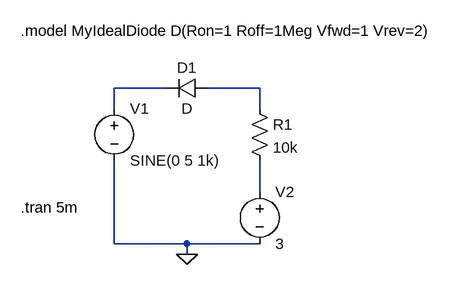
[diagram p0: schematic Clipper circuit at Bias Voltage 3V.asc]
Clipper circuit at Bias Voltage 3V.asc, the LTspice schematic file:
Version 4.1
SHEET 1 880 680
WIRE 160 80 80 80
WIRE 304 80 224 80
WIRE 80 112 80 80
WIRE 304 112 304 80
WIRE 304 240 304 192
WIRE 80 320 80 192
WIRE 192 320 80 320
WIRE 304 320 192 320
WIRE 192 336 192 320
FLAG 192 336 0
SYMBOL diode 224 64 R90
WINDOW 0 0 32 VBottom 2
WINDOW 3 32 32 VTop 2
SYMATTR InstName D1
SYMBOL res 288 96 R0
SYMATTR InstName R1
SYMATTR Value 10k
SYMBOL voltage 80 96 R0
WINDOW 123 0 0 Left 0
WINDOW 39 0 0 Left 0
SYMATTR InstName V1
SYMATTR Value SINE(0 5 1k)
SYMBOL voltage 304 224 R0
WINDOW 123 0 0 Left 0
WINDOW 39 0 0 Left 0
SYMATTR InstName V2
SYMATTR Value 3
TEXT -64 -8 Left 2 !.model MyIdealDiode D(Ron=1 Roff=1Meg Vfwd=1 Vrev=2)
TEXT -64 264 Left 2 !.tran 5m

The netlist it stands for:
* Clipper circuit at Bias Voltage 3V.asc
D1 N002 N001 D
R1 N002 N003 10k
V1 N001 0 SINE(0 5 1k)
V2 N003 0 3
.model D D
.lib standard.dio
.model MyIdealDiode D(Ron=1 Roff=1Meg Vfwd=1 Vrev=2)
.tran 5m
.backanno
.end